# Altium schematic sheet PowerSwitch.SchDoc: Power Switch
size A4; Author: Piotr Kuligowski; DocumentNumber: 13; SheetNumber: 13; SheetTotal: 16; Model: EM1; PageSetup: Record=PageOptions|CenterHorizontal=True|CenterVertical=True|PrintScale=0.52|XCorrection=1.00|YCorrection=1.00|PrintKind=1|BorderSize=5000000|LeftOffset=0|BottomOffset=0|Orientation=2|PaperLength=4200|PaperWidth=2970|Scale=100|PaperSource=7|PrintQuality=600|MediaType=1|DitherType=10|PaperKind=A3|PrintScaleMode=1
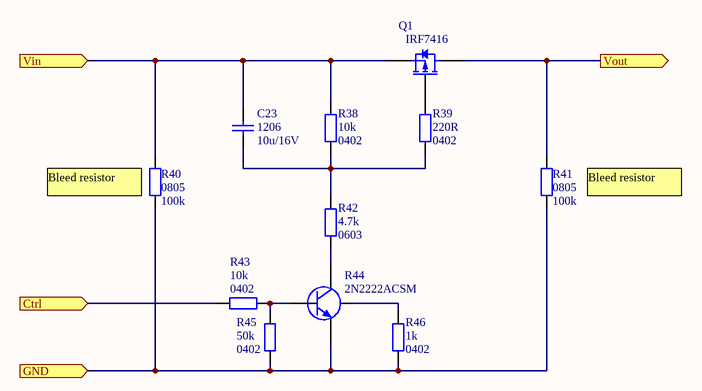
[diagram p0: PowerSwitch.SchDoc]

## Parts
C23  Packge: 1206  [SMD_Capacitor_1206]  (hidden comment: 10u/16V)
Q1  IRF7416  [SOIC-8-N_SSSGDDDD]
R38  Package: 0402  [SMD_Resistor_0402]  (hidden comment: 10k)
R39  Package: 0402  [SMD_Resistor_0402]  (hidden comment: 220R)
R40  0805  value 100k  [Resistor 0805]
R41  0805  value 100k  [Resistor 0805]
R42  Package: 0603  [SMD_Resistor_0603]  (hidden comment: 4.7k)
R43  Package: 0402  [SMD_Resistor_0402]  (hidden comment: 10k)
R44  2N2222ACSM  [LCC1-4_BEC]
R45  Package: 0402  [SMD_Resistor_0402]  (hidden comment: 50k)
R46  Package: 0402  [SMD_Resistor_0402]  (hidden comment: 1k)

## Ports
Ctrl (in), GND (in), Vin (in), Vout (out)

## Nets
Ctrl: R43.1 ; port Ctrl
GND: R40.1 R41.1 R44.E R45.2 R46.1 ; port GND
Vin: C23.1 Q1.S R38.1 R40.2 ; port Vin
Vout: Q1.D R41.2 ; port Vout
NetC23_2: C23.2 R38.2 R39.2 R42.1
NetQ1_G: Q1.G R39.1
NetR42_2: R42.2 R44.C
NetR43_2: R43.2 R44.B R45.1
NetR44_Shield: R44.Shield R46.2

## Notes on the sheet
- (near R40) Bleed resistor
- (near R41) Bleed resistor
- Title:
- Sheet:
- of
- Author:
- Model:
- Document Number:
- Checked by:
- Iss-Rev:
- Approved by:
- Date:
- File name:

## Library data of the parts
C23 = Cer_C1206T106K4RACTU: Ceramic Cap Kemet COTS 10u/16V X7R 1206; ManufacturerPartNumber: C1206T106K4RACTU; Manufacturer: Kemet; Value: 10u/16V
Q1 = IRF7416: 10A/30V HEXFET Power P-MOSFET.; Manufacturer: International Rectifier; Value: IRF7416
R38 R43 = CRCW040210K0FKxxxx: 10k/1% Vishay CRCW 0402 Resistor. 63mW, 100ppm, 50V.; Manufacturer: Vishay; ManufacturerPartNumber: CRCW040210K0FKxxxx; Value: 10k
R39 = CRCW0402220RFKxxxx: 220R/1% Vishay CRCW 0402 Resistor. 63mW, 100ppm, 50V.; Manufacturer: Vishay; ManufacturerPartNumber: CRCW0402220RFKxxxx; Value: 220R
R40 R41 = Res2: Resistor; Published: 8-Jun-2000; LatestRevisionDate: 17-Jul-2002; LatestRevisionNote: Re-released for DXP Platform.; PackageReference: AXIAL-0.4; Publisher: Altium Limited; PackageDescription: Axial Device, Thru-Hole; 2 Leads; 0.4 in Pin Spacing
R42 = CRCW06034K70FKxxxx: 4.7k/1% Vishay CRCW 0603 Resistor. 100mW, 100ppm, 75V.; Manufacturer: Vishay; ManufactuerPartNumber: CRCW06034K70FKxxxx; Value: 4.7k
R44 = 2N2222ACSM: Silicon Planar Epitaxial NPN Transistor.; Manufacturer: Semelab-TT; Value: 2N2222ACSM
R45 = CRCW0402100KFKxxxx: 100k/1% Vishay CRCW 0402 Resistor. 63mW, 100ppm, 50V.; Manufacturer: Vishay; ManufacturerPartNumber: CRCW0402100KFKxxxx; Value: 50k
R46 = CRCW04021K00FKxxxx: 1k/1% Vishay CRCW 0402 Resistor. 63mW, 100ppm, 50V.; Manufacturer: Vishay; ManufacturerPartNumber: CRCW04021K00FKxxxx; Value: 1k